# EAGLE design Steuerung (EAGLE 7.2.0)
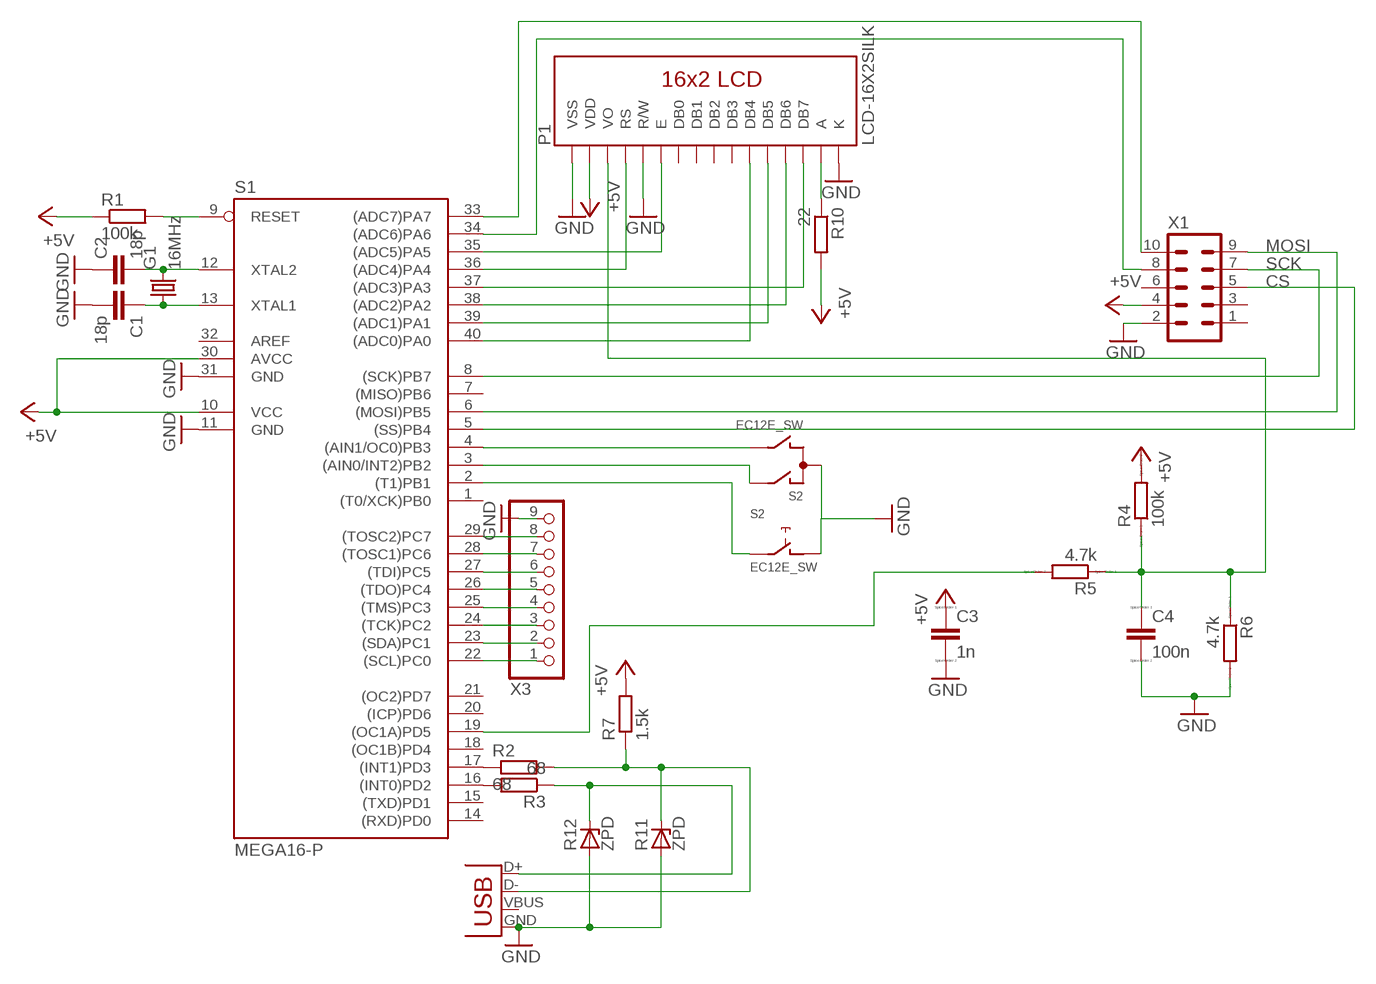
[diagram p0: schematic, sheet 1]

## Parts
C1  18p  C2,5-3  [C2.5-3]
C2  18p  C2,5-3  [C2.5-3]
C3  1n  C-EUC1206K  [C1206K]
C4  100n  C-EUC1206K  [C1206K]
G1  16MHz  CRYSTALHC18U-V  [HC18U-V]
P1  LCD-16X2SILK  [LCD-16X2]
R1  100k  R-EU_R1206W  [R1206W]
R2  68  R-EU_0309/12  [0309/12]
R3  68  R-EU_0309/12  [0309/12]
R4  100k  R-EU_R1206W  [R1206W]
R5  4.7k  R-EU_R1206W  [R1206W]
R6  4.7k  R-EU_R1206W  [R1206W]
R7  1.5k  R-EU_0309/12  [0309/12]
R10  22  R-EU_0309/12  [0309/12]
R11  ZPD  [DO35Z10]
R12  ZPD  [DO35Z10]
S1  MEGA16-P  [DIL40]
S2  EC12E_SW  [ALPS_EC12E_SW]
X1  ML10  [ML10]
X2  USBPTH-VERTICAL  [USB-B-PTH-VERTICAL]
X3  PINHD-1X9  [1X09]

## Nets
+5V: C3.1 P1.2(VDD) R1.1 R4.2 R7.2 R10.2 S1.10(VCC) S1.30(AVCC) X1.4
CS: S1.5((SS)PB4) X1.5
GND: C1.2 C2.1 C3.2 C4.2 P1.1(VSS) P1.5(R/W) P1.16(K) R6.2 R11.A R12.A S1.11(GND) S1.31(GND) S2.C S2.D X1.2 X2.GND X3.9
KONTRAST: C4.1 P1.3(VO) R4.1 R5.1 R6.1
MOSI: S1.6((MOSI)PB5) X1.9
N$1: S1.34((ADC6)PA6) X1.8
N$2: S1.4((AIN1/OC0)PB3) S2.B
N$3: S1.3((AIN0/INT2)PB2) S2.A
N$4: S1.2((T1)PB1) S2.E
N$5: R1.2 S1.9(RESET)
N$9: P1.14(DB7) S1.37((ADC3)PA3)
N$10: P1.4(RS) S1.36((ADC4)PA4)
N$11: P1.6(E) S1.35((ADC5)PA5)
N$12: P1.13(DB6) S1.38((ADC2)PA2)
N$13: P1.12(DB5) S1.39((ADC1)PA1)
N$14: P1.11(DB4) S1.40((ADC0)PA0)
N$15: P1.15(A) R10.1
N$17: S1.33((ADC7)PA7) X1.10
N$21: S1.29((TOSC2)PC7) X3.8
N$22: S1.28((TOSC1)PC6) X3.7
N$23: S1.27((TDI)PC5) X3.6
N$24: S1.26((TDO)PC4) X3.5
N$25: S1.25((TMS)PC3) X3.4
N$26: S1.24((TCK)PC2) X3.3
N$27: S1.23((SDA)PC1) X3.2
N$28: S1.22((SCL)PC0) X3.1
N$29: C1.1 G1.1 S1.13(XTAL1)
N$30: C2.2 G1.2 S1.12(XTAL2)
N$31: R3.2 S1.16((INT0)PD2)
N$32: R2.1 S1.17((INT1)PD3)
N$33: R3.1 R12.C X2.D+
N$34: R2.2 R7.1 R11.C X2.D-
PWM: R5.2 S1.19((OC1A)PD5)
SCK: S1.8((SCK)PB7) X1.7
Unconnected: P1.7(DB0) P1.8(DB1) P1.9(DB2) P1.10(DB3) S1.1((T0/XCK)PB0) S1.7((MISO)PB6) S1.14((RXD)PD0) S1.15((TXD)PD1) S1.18((OC1B)PD4) S1.20((ICP)PD6) S1.21((OC2)PD7) S1.32(AREF) S2.GND1(G) S2.GND2(G) X1.1 X1.3 X1.6 X2.VBUS

## Library data of the parts
C1 C2 = capacitor-wima:C: CAPACITOR naming: grid - package width; OC_FARNELL: unknown
C3 C4 = resistor:C-EU: CAPACITOR, European symbol; OC_FARNELL: unknown; SPICEPREFIX: C
G1 = crystal:CRYSTAL: CRYSTAL; OC_FARNELL: unknown; OC_NEWARK: unknown
P1 = SparkFun-Displays:LCD-16X2: Standard text-only 16x2 parallel input LCD; OC_FARNELL: unknown
R1-R3 R7 R10 = rcl:R-EU_: RESISTOR, European symbol; OC_FARNELL: unknown
R4-R6 = resistor:R-EU_: RESISTOR, European symbol; SPICEPREFIX: R
R11 R12 = diode:ZPD: Z DIODE 500 mW; OC_FARNELL: unknown
S1 = atmel:MEGA16-P: MICROCONTROLLER 16 Kbytes FLASH 1 kbytes SRAM 512 bytes EEPROM USART 8-channel 10 bit ADC Source: avr.lbr; MF: ATMEL; MPN: ATMEGA16-16PU; OC_FARNELL: 9171142; OC_NEWARK: 01M6885
S2 = switch-alps:EC12E_SW: ALPS rotary Encoder EC12E series with switch; MPN: EC12E2424407; OC_FARNELL: 1520813; OC_NEWARK: 74M1068
X1 = con-harting-ml:ML10: HARTING; OC_FARNELL: unknown; OC_NEWARK: unknown
X2 = SparkFun-Connectors:USB: USB Connectors USB-B-PTH is fully proven SKU : PRT-00139/CONN-08278 USB-miniB is fully proven SKU : PRT-00587 USB-A-PCB is untested. USB-A-H is throughly reviewed, but untested. Spark Fun Electronics SKU : PRT-00437 USB-B-SMT is throughly reviewed, but untested. Needs silkscreen touching up. USB-A-S has not been used/tested USB-MB-H has not been used/tested USB-MICROB has been used. CONN-09505; OC_FARNELL: unknown
X3 = pinhead:PINHD-1X9: PIN HEADER; OC_FARNELL: unknown

## Board
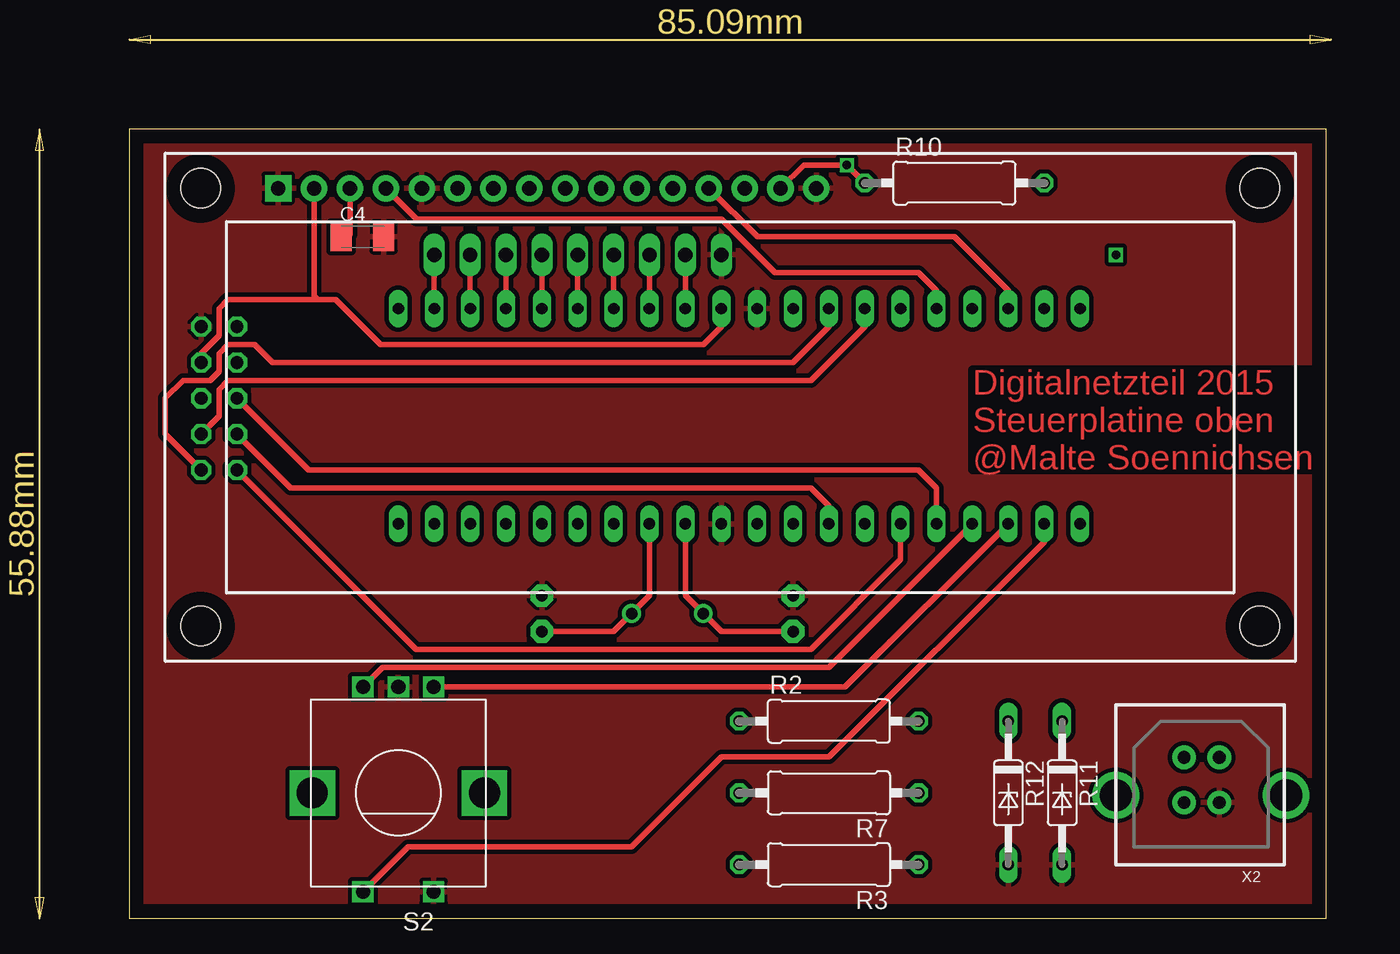
[diagram p1: board, top side]
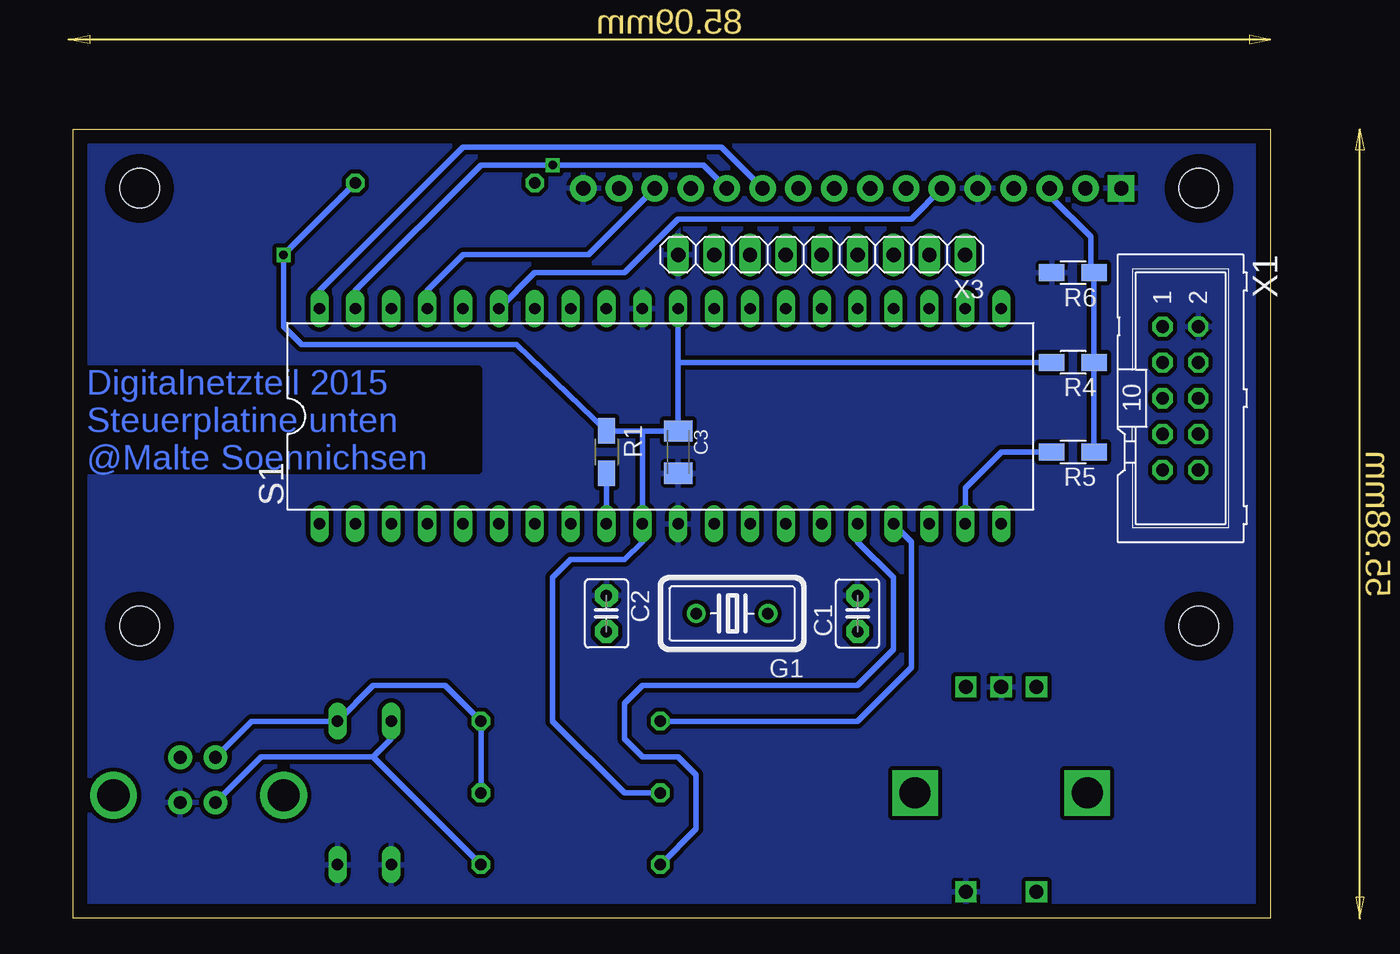
[diagram p2: board, bottom side, seen from below]

Size 84.76 x 55.87 mm. Coordinates in mm from the lower left corner, seen from the top.
Outline: 0,0 84.76,0 84.76,55.87 0,55.87 0,0
Copper layers (1*16): Top 0.035mm / dielectric 1.5mm / Bottom 0.035mm
Design rules "default": minimum track width 10mil, minimum drill 24mil, track to track 8mil, track to pad 8mil, pad to pad 8mil, via to via 8mil, smd to smd 8mil, copper to edge 40mil, drill to drill 8mil, minimum pad ring 10mil, minimum via ring 8mil, stop-mask expansion 4mil, vias tented up to drill 0mil, thermal gap 10mil

### Footprints (pad centres in the part's own frame; a part is rotated, then mirrored left to right if it is on the bottom)
C2.5-3 = drill 0.813 pad 1.6 octagon: 1 -1.27,0; 2 1.27,0
C1206K = smd 1.5 x 2: 1 -1.5,0; 2 1.5,0
HC18U-V = drill 0.813: 1 -2.54,0; 2 2.54,0
LCD-16X2 = drill 1.016 pad 1.88 square: 1 -32,15.5 | drill 1.016 pad 1.88: 2 -29.46,15.5; 3 -26.92,15.5; 4 -24.38,15.5; 5 -21.84,15.5; 6 -19.3,15.5; 7 -16.76,15.5; 8 -14.22,15.5; 9 -11.68,15.5; 10 -9.14,15.5; 11 -6.6,15.5; 12 -4.06,15.5; 13 -1.52,15.5; 14 1.02,15.5; 15 3.56,15.5; 16 6.1,15.5 | hole 2.8: -37.5,15.5; -37.5,-15.5; 37.5,15.5; 37.5,-15.5
R1206W = smd 1.8 x 1.2: 1 -1.499,0; 2 1.499,0
0309/12 = drill 0.813 octagon: 1 -6.35,0; 2 6.35,0
DO35Z10 = drill 0.813 long: A 5.08,0; C -5.08,0
DIL40 = drill 0.813 long: 1 -24.13,-7.62; 2 -21.59,-7.62; 3 -19.05,-7.62; 4 -16.51,-7.62; 5 -13.97,-7.62; 6 -11.43,-7.62; 7 -8.89,-7.62; 8 -6.35,-7.62; 9 -3.81,-7.62; 10 -1.27,-7.62; 11 1.27,-7.62; 12 3.81,-7.62; 13 6.35,-7.62; 14 8.89,-7.62; 15 11.43,-7.62; 16 13.97,-7.62; 17 16.51,-7.62; 18 19.05,-7.62; 19 21.59,-7.62; 20 24.13,-7.62; 21 24.13,7.62; 22 21.59,7.62; 23 19.05,7.62; 24 16.51,7.62; 25 13.97,7.62; 26 11.43,7.62; 27 8.89,7.62; 28 6.35,7.62; 29 3.81,7.62; 30 1.27,7.62; 31 -1.27,7.62; 32 -3.81,7.62; 33 -6.35,7.62; 34 -8.89,7.62; 35 -11.43,7.62; 36 -13.97,7.62; 37 -16.51,7.62; 38 -19.05,7.62; 39 -21.59,7.62; 40 -24.13,7.62
ALPS_EC12E_SW = drill 1 square: A -2.5,-7.5; B 2.5,-7.5; C 0,-7.5; D -2.5,7; E 2.5,7 | drill 2.2 square: GND1 -6.1,0; GND2 6.1,0
ML10 = drill 0.914 octagon: 1 -5.08,-1.27; 2 -5.08,1.27; 3 -2.54,-1.27; 4 -2.54,1.27; 5 0,-1.27; 6 0,1.27; 7 2.54,-1.27; 8 2.54,1.27; 9 5.08,-1.27; 10 5.08,1.27
USB-B-PTH-VERTICAL = drill 0.914 pad 1.676: D+ 4.826,4.394; D- 4.826,7.595; GND 7.315,4.394; VBUS 7.315,7.595 | drill 2.286: P$1 0,4.902; P$2 12.04,4.902
1X09 = drill 1.016 long: 1 -10.16,0; 2 -7.62,0; 3 -5.08,0; 4 -2.54,0; 5 0,0; 6 2.54,0; 7 5.08,0; 8 7.62,0; 9 10.16,0

### Placement (x,y rotation side)
C1  29.21,21.59 90 bottom
C2  46.99,21.59 270 bottom
C3  41.91,33.02 270 bottom
C4  16.51,48.26 0 top
G1  38.1,21.59 180 bottom
P1  42.55,36.2 0 top
R1  46.99,33.02 270 bottom
R2  49.53,13.97 0 top
R3  49.53,3.81 180 top
R4  13.97,39.37 180 bottom
R5  13.97,33.02 180 bottom
R6  13.97,45.72 180 bottom
R7  49.53,8.89 180 top
R10  58.42,52.07 0 top
R11  66.04,8.89 270 top
R12  62.23,8.89 270 top
S1  43.18,35.56 0 bottom
S2  19.05,8.89 180 top
X1  6.35,36.83 270 bottom
X2  69.85,3.81 0 top
X3  31.75,46.99 180 bottom

### Tracks (layer width: path | path; a pad name or v marks a point on that pad's centre or on a via)
+5V  (via drill 0.6)
  Top 0.406: X1.4 5.08,40.01 6.35,41.27 6.35,43.18 6.99,43.81 13.34,43.81 | 13.34,43.81 13.09,44.06 P1.2 | 13.34,43.81 14.61,43.81 17.78,40.64 40.64,40.64 41.91,41.91 S1.30
  Bottom 0.406: R7.2 45.72,8.89 50.8,13.97 50.8,24.13 49.53,25.4 45.72,25.4 44.45,26.67 S1.10 44.45,34.52 | R10.2 v69.85,46.99 69.85,41.91 68.58,40.64 53.34,40.64 R1.1 44.45,34.52 | 41.91,39.37 C3.1 44.45,34.52 | 41.91,39.37 S1.30 | R4.2 41.91,39.37
CS
  Top 0.406: X1.5 12.7,31.75 55.88,31.75 57.15,30.48 S1.5
GND
  pour Bottom (isolate 0.305): 0,55.88 0,0 85.09,0 85.09,55.88
  pour Top (isolate 0.305): 0,55.88 85.09,55.88 85.09,0 0,0
KONTRAST
  Top 0.406: C4.1 15.62,48.41 P1.3
  Bottom 0.406: P1.3 15.62,51.19 12.7,48.26 12.7,45.95 R6.1 R4.1 R5.1
MOSI
  Top 0.406: X1.9 20.32,19.05 48.26,19.05 54.61,25.4 S1.6
N$1
  Top 0.406: X1.8 6.35,35.56 6.35,37.47 6.99,38.1 48.26,38.1 52.07,41.91 S1.34
N$2
  Top 0.406: S2.B 17.94,17.78 49.53,17.78 S1.4
N$3
  Top 0.406: S1.3 50.68,16.39 S2.A
N$4
  Top 0.406: S2.E 19.74,5.08 35.56,5.08 41.91,11.43 49.53,11.43 64.77,26.67 S1.2
N$5
  Bottom 0.406: R1.2 S1.9
N$9
  Bottom 0.406: P1.14 48.27,46.99 57.15,46.99 59.69,44.45 S1.37
N$10
  Top 0.406: P1.4 20.33,49.53 41.91,49.53 45.72,45.72 55.88,45.72 57.15,44.45 S1.36
N$11
  Bottom 0.406: P1.6 25.41,49.53 41.91,49.53 45.72,45.72 52.07,45.72 S1.35
N$12
  Top 0.406: P1.13 44.46,48.26 58.42,48.26 62.23,44.45 S1.38
N$13
  Bottom 0.406: P1.12 40.13,53.34 55.88,53.34 64.77,44.45 S1.39
N$14
  Bottom 0.406: P1.11 38.86,54.61 57.15,54.61 67.31,44.45 S1.40
N$15  (via drill 0.6)
  Top 0.406: P1.15 47.75,53.34 v50.8,53.34 R10.1
N$17
  Top 0.406: X1.10 2.54,34.29 2.54,36.83 3.81,38.1 5.71,38.1 6.35,38.73 6.35,40.01 6.99,40.64 8.89,40.64 10.16,39.37 46.99,39.37 49.53,41.91 S1.33
N$21
  Top 0.406: X3.8 S1.29
N$22
  Top 0.406: X3.7 S1.28
N$23
  Top 0.406: X3.6 S1.27
N$24
  Top 0.406: X3.5 S1.26
N$25
  Top 0.406: X3.4 S1.25
N$26
  Top 0.406: X3.3 S1.24
N$27
  Top 0.406: X3.2 S1.23
N$28
  Top 0.406: X3.1 S1.22
N$29
  Top 0.406: S1.13 36.83,22.86 G1.1 34.29,20.32 C1.1
N$30
  Top 0.406: S1.12 39.37,22.86 G1.2 41.91,20.32 C2.2
N$31
  Bottom 0.406: R3.2 40.64,6.35 40.64,10.16 41.91,11.43 44.45,11.43 45.72,12.7 45.72,15.24 44.45,16.51 29.21,16.51 26.67,19.05 26.67,24.13 29.21,26.67 S1.16
N$32
  Bottom 0.406: R2.1 29.21,13.97 25.4,17.78 25.4,26.67 S1.17
N$33
  Bottom 0.406: X2.D+ 71.45,11.43 63.5,11.43 | 63.5,11.43 62.23,12.7 R12.C | 63.5,11.43 R3.1
N$34
  Bottom 0.406: X2.D- 72.11,13.97 R11.C 63.5,16.51 58.42,16.51 R2.2 R7.1
PWM
  Bottom 0.406: R5.2 19.05,33.02 21.59,30.48 S1.19
SCK
  Top 0.406: X1.7 11.43,30.48 48.26,30.48 49.53,29.21 S1.8

### Text on the board
Top: Digitalnetzteil 2015 / Steuerplatine oben / @Malte Soennichsen
Bottom: Digitalnetzteil 2015 / Steuerplatine unten / @Malte Soennichsen